# EAGLE design r0ndL-HPMountsPlus (EAGLE 7.5.0)
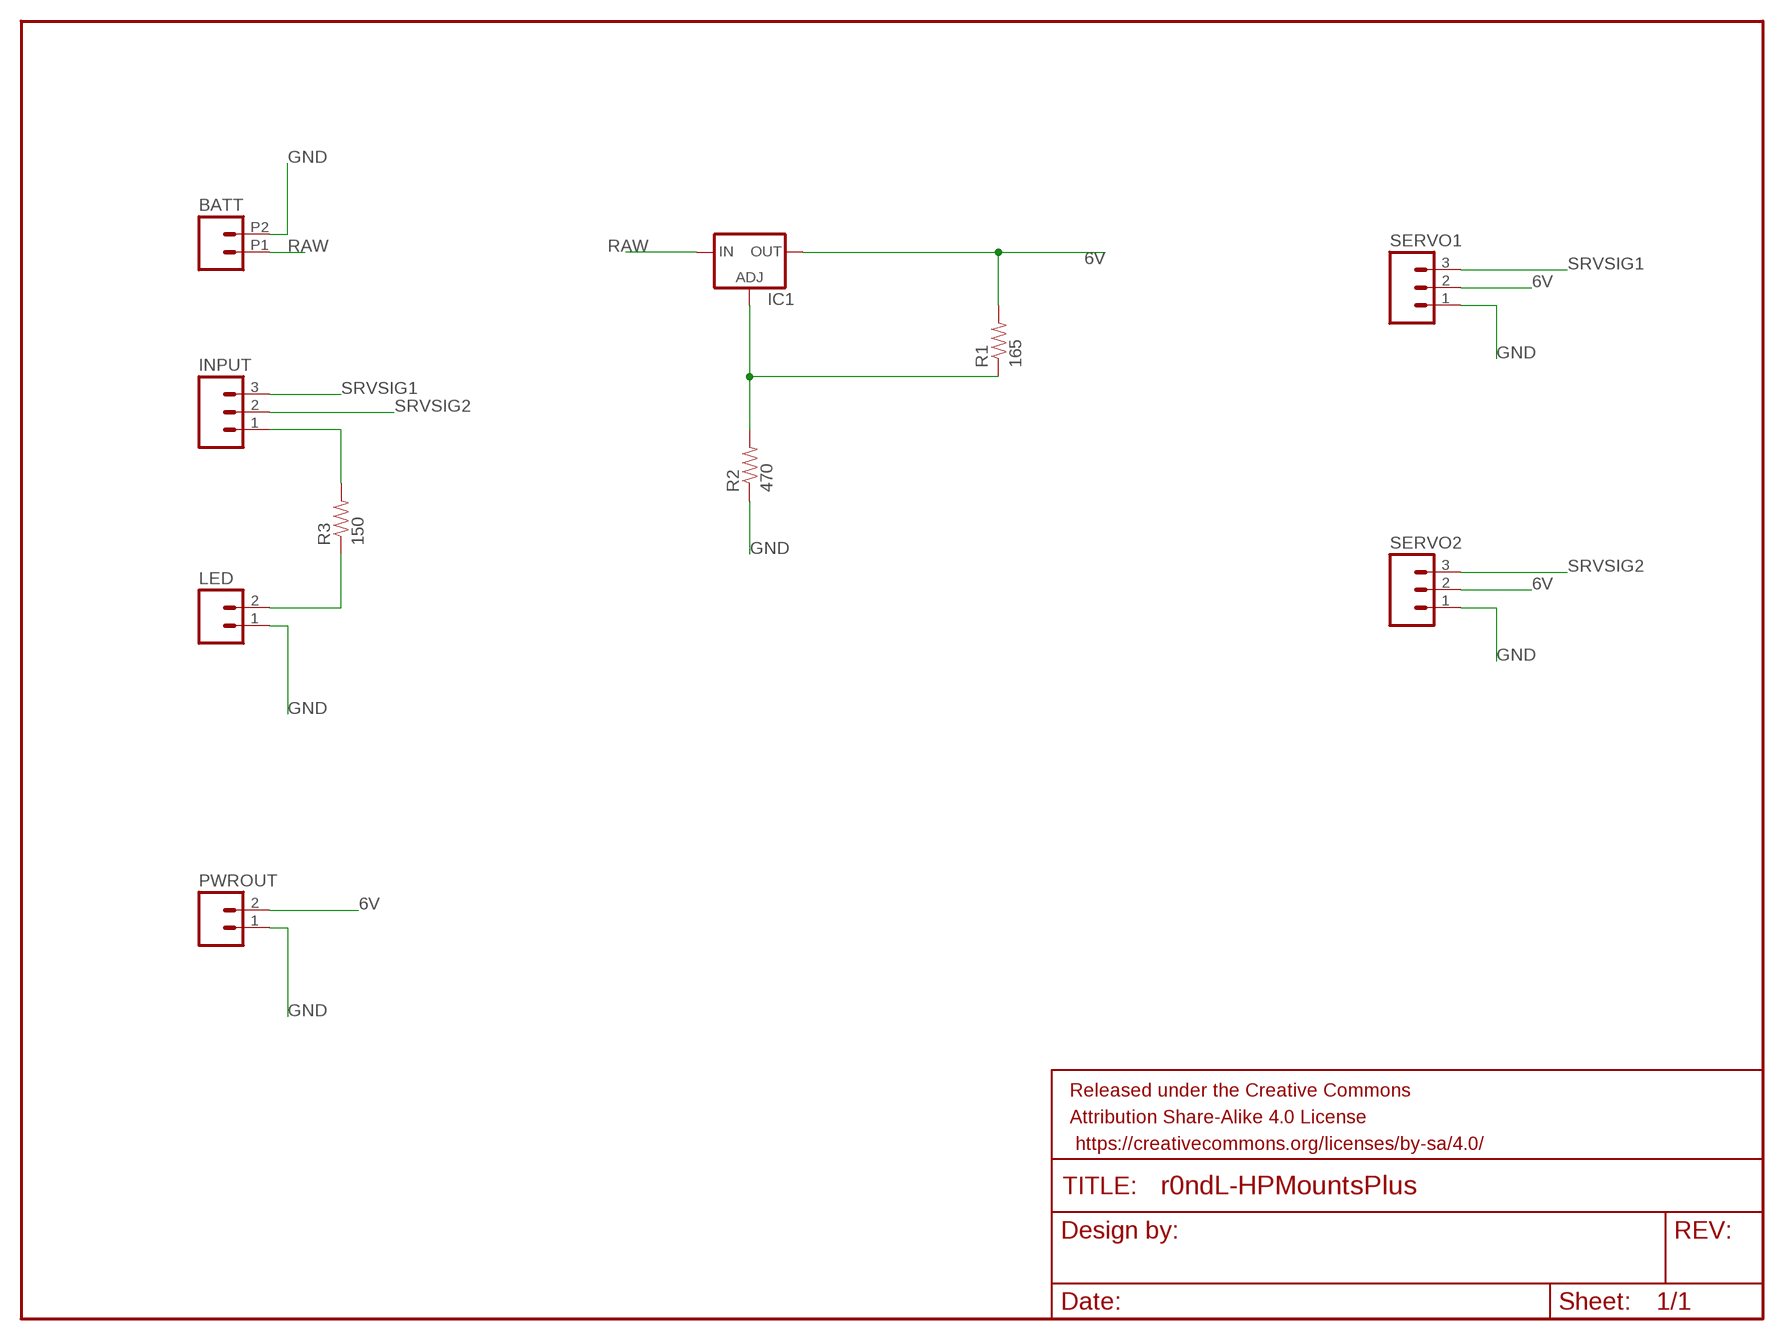
[diagram p0: schematic, sheet 1]

## Parts
BATT  M022.54MM_SCREWTERM  [1X02_2.54_SCREWTERM]
FRAME1  FRAME-LETTER  [CREATIVE_COMMONS]
IC1  LM317TS  [317TS]
INPUT  M03PTH  [1X03]
LED  M02PTH  [1X02]
PWROUT  M02PTH  [1X02]
R1  165  RESISTORPTH-1/4W  [AXIAL-0.4]
R2  470  RESISTORPTH-1/4W  [AXIAL-0.4]
R3  150  RESISTORPTH-1/4W  [AXIAL-0.4]
SERVO1  M03PTH  [1X03]
SERVO2  M03PTH  [1X03]

## Nets
6V: IC1.2(OUT) PWROUT.2 R1.P$2 SERVO1.2 SERVO2.2
GND: BATT.P2 LED.1 PWROUT.1 R2.P$1 SERVO1.1 SERVO2.1
N$2: IC1.1(ADJ) R1.P$1 R2.P$2
N$3: LED.2 R3.P$1
N$4: INPUT.1 R3.P$2
RAW: BATT.P1 IC1.3(IN)
SRVSIG1: INPUT.3 SERVO1.3
SRVSIG2: INPUT.2 SERVO2.3

## Library data of the parts
BATT LED PWROUT = SparkFun-Connectors:M02: Standard 2-pin 0.1" header. Use with - straight break away headers ( PRT-00116) - right angle break away headers (PRT-00553) - swiss pins (PRT-00743) - machine pins (PRT-00117) - female headers (PRT-00115) Molex polarized connector foot print use with: PRT-08233 with associated crimp pins and housings. 2.54_SCREWTERM for use with PRT-10571. 3.5mm Screw Terminal footprints for PRT-08084 5mm Screw Terminal footprints for use with PRT-08432
FRAME1 = SparkFun-Aesthetics:FRAME-LETTER: Schematic Frame Standard 8.5x11 US Letter frame
IC1 = v-reg:LM317TS: VOLTAGE REGULATOR
INPUT SERVO1 SERVO2 = SparkFun-Connectors:M03: Header 3 Standard 3-pin 0.1" header. Use with straight break away headers (SKU : PRT-00116), right angle break away headers (PRT-00553), swiss pins (PRT-00743), machine pins (PRT-00117), and female headers (PRT-00115). Molex polarized connector foot print use with SKU : PRT-08232 with associated crimp pins and housings.
R1-R3 = SparkFun-Resistors:RESISTOR: Resistor Basic schematic elements and footprints for 0603, 1206, and PTH resistors.

## Board
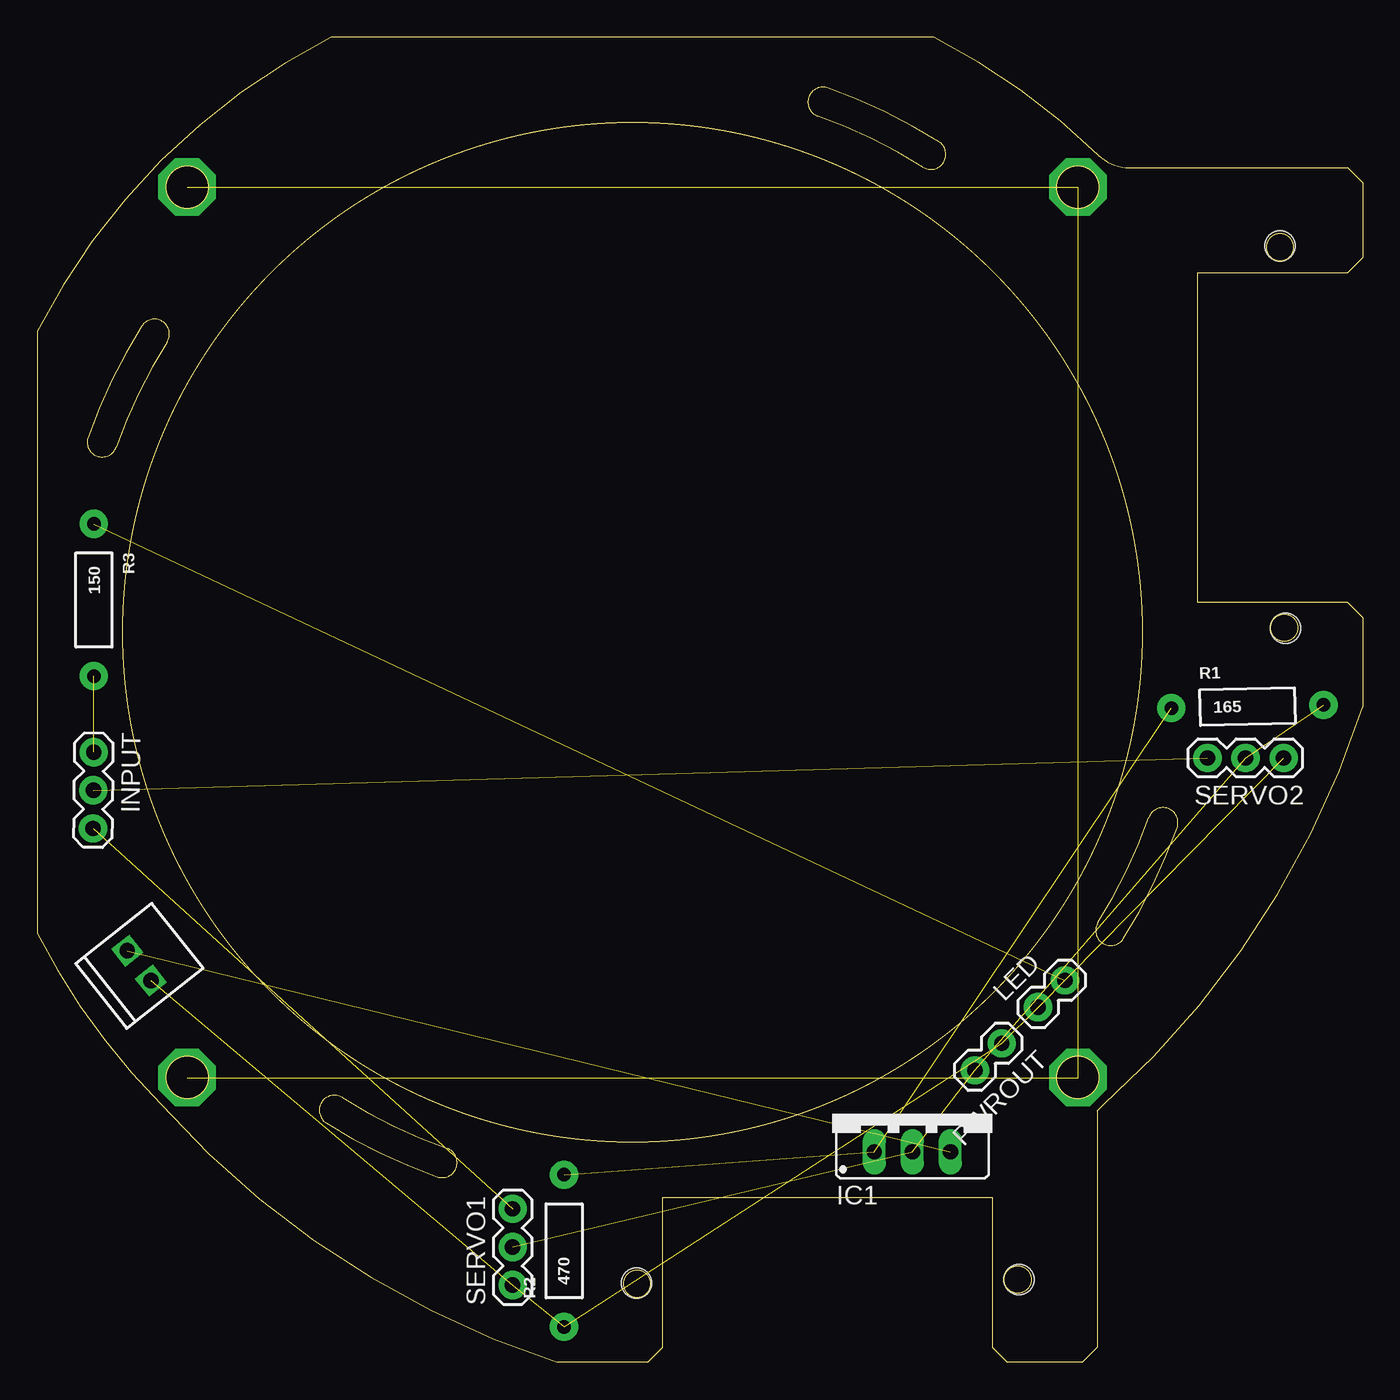
[diagram p1: board, top side]

Size 88.4 x 88.4 mm. Coordinates in mm from the lower left corner, seen from the top.
Outline: 26.66,12.37 arc180 27.33,14.25 arc-12 20.33,17.65 arc180 19.27,15.95 arc12 26.66,12.37
Outline: 76.03,35.66 arc180 74.14,36.33 arc-12 70.75,29.33 arc180 72.44,28.27 arc12 76.03,35.66
Outline: 59.07,79.75 arc180 60.13,81.44 arc12 52.74,85.03 arc180 52.06,83.14 arc-12 59.07,79.75
Outline: 8.65,68.07 arc180 6.95,69.13 arc12 3.37,61.74 arc180 5.25,61.06 arc-12 8.65,68.07
Outline: 69.7,0 64.7,0 63.7,1 63.7,11 41.7,11 41.7,1 40.7,0 34.7,0 arc-30 8.23,17.23 arc-18 0,28.59 0,68.81 arc-36 19.59,88.4 59.81,88.4 arc-17 70.77,80.55 arc44 72.87,79.7 87.4,79.7 88.4,78.7 88.4,73.7 87.4,72.7 77.4,72.7 77.4,50.7 87.4,50.7 88.4,49.7 88.4,43.7 arc-30 71.16,17.23 arc-1 70.7,16.77 70.7,1 69.7,0
Outline: circle at 40,5.22 radius 0.9
Outline: circle at 65.4,5.5 radius 0.9
Outline: circle at 83.17,49 radius 0.9
Outline: circle at 82.9,74.4 radius 0.9
Outline: circle at 10,19 radius 1.4
Outline: circle at 69.4,78.4 radius 1.4
Outline: circle at 39.7,48.7 radius 34
Outline: circle at 69.4,19 radius 1.4
Outline: circle at 10,78.4 radius 1.4
Copper layers (1*16): Top 0.035mm / dielectric 1.5mm / Bottom 0.035mm
Design rules "default": minimum track width 10mil, minimum drill 24mil, track to track 8mil, track to pad 8mil, pad to pad 8mil, via to via 8mil, smd to smd 8mil, copper to edge 40mil, drill to drill 8mil, minimum pad ring 10mil, minimum via ring 8mil, stop-mask expansion 4mil, vias tented up to drill 0mil, thermal gap 10mil
Holes 2 mm at 82.88,74.48 39.95,5.26 83.26,48.95 65.48,5.52

### Footprints (pad centres in the part's own frame; a part is rotated, then mirrored left to right if it is on the bottom)
1X02_2.54_SCREWTERM = drill 1.016 square: P1 2.54,0; P2 0,0
317TS = drill 1.016 long: 1 -2.54,-2.54; 2 0,-2.54; 3 2.54,-2.54
1X03 = drill 1.016 pad 1.88: 1 0,0; 2 2.54,0; 3 5.08,0
1X02 = drill 1.016 pad 1.88: 1 0,0; 2 2.54,0
AXIAL-0.4 = drill 0.9 pad 1.88: P$1 -5.08,0; P$2 5.08,0

### Placement (x,y rotation side)
BATT  7.57,25.46 128.3 top
FRAME1  11.38,-8.83 0 top  (outside the outline)
IC1  58.37,16.57 0 top
INPUT  3.76,40.7 269.4 top
LED  66.75,23.68 45 top
PWROUT  64.34,21.27 225 top
R1  80.72,43.75 1.2 top
R2  35.13,7.42 90 top
R3  3.76,50.86 270 top
SERVO1  31.7,5.14 90 top
SERVO2  83.13,40.32 180 top

### Tracks (layer width: path | path; a pad name or v marks a point on that pad's centre or on a via)
6V  (4 unrouted)
GND  (5 unrouted)
N$1  (via drill 2.8)  (3 unrouted)
  other vias: 9.98,18.98 69.42,18.98 9.98,78.42 69.42,78.42
N$2  (2 unrouted)
N$3  (1 unrouted)
N$4  (1 unrouted)
RAW  (1 unrouted)
SRVSIG1  (1 unrouted)
SRVSIG2  (1 unrouted)